# Altium schematic sheet mainSchematic.SchDoc
size A4
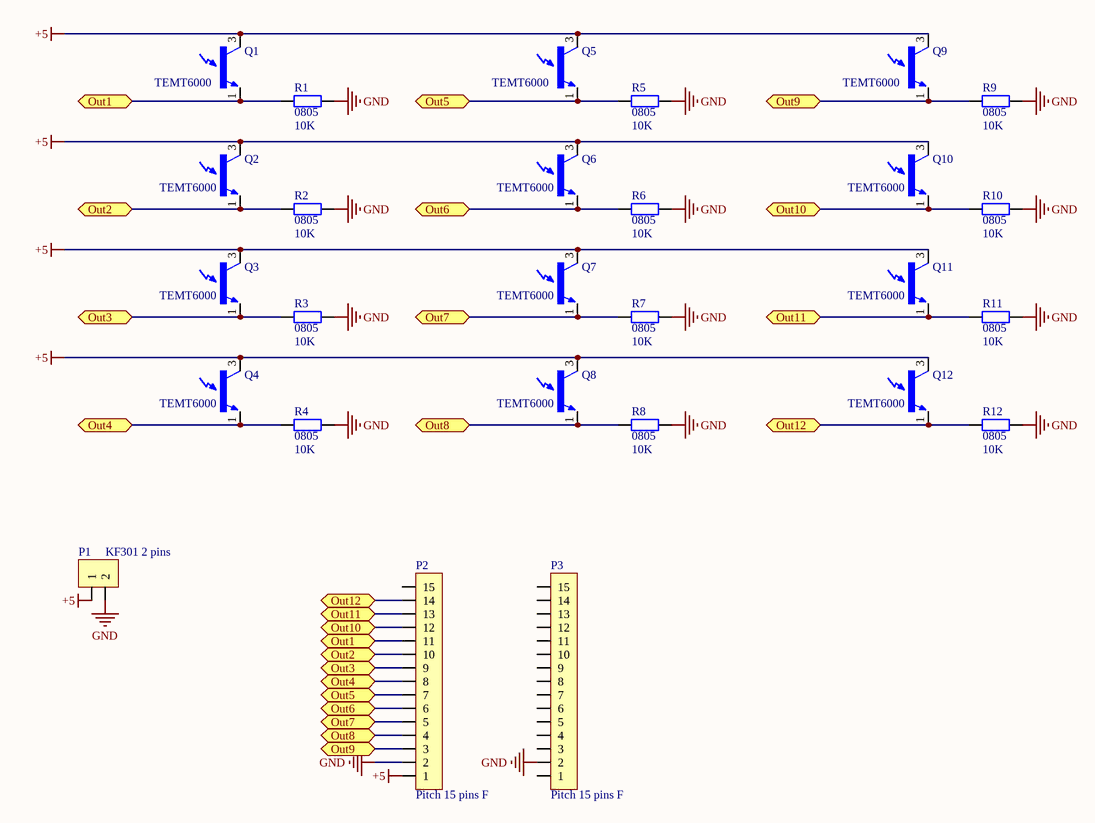
[diagram p0: mainSchematic.SchDoc]

## Parts
P1  KF301 2 pins  [Kf301 2 PINS]
P2  Pitch 15 pins F  [Pitch female 15 pins]
P3  Pitch 15 pins F  [Pitch female 15 pins]
Q1  TEMT6000  [TEMT6000]
Q2  TEMT6000  [TEMT6000]
Q3  TEMT6000  [TEMT6000]
Q4  TEMT6000  [TEMT6000]
Q5  TEMT6000  [TEMT6000]
Q6  TEMT6000  [TEMT6000]
Q7  TEMT6000  [TEMT6000]
Q8  TEMT6000  [TEMT6000]
Q9  TEMT6000  [TEMT6000]
Q10  TEMT6000  [TEMT6000]
Q11  TEMT6000  [TEMT6000]
Q12  TEMT6000  [TEMT6000]
R1  0805  value 10K  [Resistor SMD 0805]
R2  0805  value 10K  [Resistor SMD 0805]
R3  0805  value 10K  [Resistor SMD 0805]
R4  0805  value 10K  [Resistor SMD 0805]
R5  0805  value 10K  [Resistor SMD 0805]
R6  0805  value 10K  [Resistor SMD 0805]
R7  0805  value 10K  [Resistor SMD 0805]
R8  0805  value 10K  [Resistor SMD 0805]
R9  0805  value 10K  [Resistor SMD 0805]
R10  0805  value 10K  [Resistor SMD 0805]
R11  0805  value 10K  [Resistor SMD 0805]
R12  0805  value 10K  [Resistor SMD 0805]

## Ports
Out1, Out2, Out3, Out4, Out5, Out6, Out7, Out8, Out9, Out10, Out11, Out12

## Nets
+5: P1.1 P2.1 Q1.3 Q2.3 Q3.3 Q4.3 Q5.3 Q6.3 Q7.3 Q8.3 Q9.3 Q10.3 Q11.3 Q12.3
GND: P1.2 P2.2 P3.2 R1.2 R2.2 R3.2 R4.2 R5.2 R6.2 R7.2 R8.2 R9.2 R10.2 R11.2 R12.2
Out1: P2.11 Q1.1 R1.1 ; port Out1
Out2: P2.10 Q2.1 R2.1 ; port Out2
Out3: P2.9 Q3.1 R3.1 ; port Out3
Out4: P2.8 Q4.1 R4.1 ; port Out4
Out5: P2.7 Q5.1 R5.1 ; port Out5
Out6: P2.6 Q6.1 R6.1 ; port Out6
Out7: P2.5 Q7.1 R7.1 ; port Out7
Out8: P2.4 Q8.1 R8.1 ; port Out8
Out9: P2.3 Q9.1 R9.1 ; port Out9
Out10: P2.12 Q10.1 R10.1 ; port Out10
Out11: P2.13 Q11.1 R11.1 ; port Out11
Out12: P2.14 Q12.1 R12.1 ; port Out12

Not connected (* = marked no-connect by the designer): P2 15; P3 1 3 4 5 6 7 8 9 10 11 12 13 14 15

## Library data of the parts
P1 = KF301 2 pins: KF301 16A
Q1-Q12 = TEMT6000: TEMT6000 LDR SMD
R1-R12 = Resistor SMD 0805